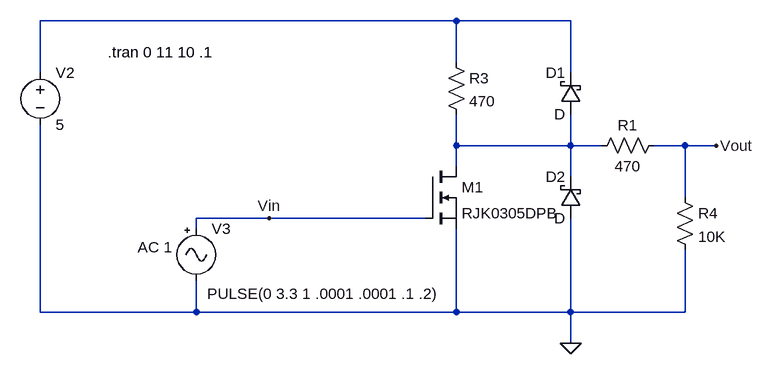
[diagram p0: schematic spank_dig_output_fet.asc]
spank_dig_output_fet.asc, the LTspice schematic file:
Version 4
SHEET 1 896 784
WIRE 176 176 -464 176
WIRE 352 176 176 176
WIRE 176 240 176 176
WIRE -464 256 -464 176
WIRE 352 256 352 176
WIRE 176 368 176 320
WIRE 352 368 352 320
WIRE 352 368 176 368
WIRE 400 368 352 368
WIRE 528 368 480 368
WIRE 576 368 528 368
WIRE 176 400 176 368
WIRE 352 416 352 368
WIRE 528 448 528 368
WIRE -112 480 -224 480
WIRE 128 480 -112 480
WIRE -224 496 -224 480
WIRE -464 624 -464 336
WIRE -224 624 -224 576
WIRE -224 624 -464 624
WIRE 176 624 176 496
WIRE 176 624 -224 624
WIRE 352 624 352 480
WIRE 352 624 176 624
WIRE 528 624 528 528
WIRE 528 624 352 624
WIRE 352 672 352 624
FLAG 352 672 0
FLAG -112 480 Vin
FLAG 576 368 Vout
SYMBOL res 496 352 R90
WINDOW 0 0 56 VBottom 2
WINDOW 3 32 56 VTop 2
SYMATTR InstName R1
SYMATTR Value 470
SYMBOL Misc\\signal -224 480 R0
WINDOW 123 -90 44 Left 2
WINDOW 39 0 0 Left 0
WINDOW 3 17 116 Left 2
SYMATTR Value2 AC 1
SYMATTR Value PULSE(0 3.3 1 .0001 .0001 .1 .2)
SYMATTR InstName V3
SYMBOL voltage -464 240 R0
WINDOW 123 0 0 Left 0
WINDOW 39 0 0 Left 0
SYMATTR InstName V2
SYMATTR Value 5
SYMBOL schottky 368 320 R180
WINDOW 0 24 64 Left 2
WINDOW 3 24 0 Left 2
SYMATTR InstName D1
SYMBOL schottky 368 480 R180
WINDOW 0 24 64 Left 2
WINDOW 3 24 0 Left 2
SYMATTR InstName D2
SYMBOL nmos 128 400 R0
SYMATTR InstName M1
SYMATTR Value RJK0305DPB
SYMBOL res 160 224 R0
SYMATTR InstName R3
SYMATTR Value 470
SYMBOL res 512 432 R0
SYMATTR InstName R4
SYMATTR Value 10K
TEXT -360 224 Left 2 !.tran 0 11 10 .1

The netlist it stands for:
* spank_dig_output_fet.asc
R1 Vout N002 470
V3 Vin 0 PULSE(0 3.3 1 .0001 .0001 .1 .2) AC 1
V2 N001 0 5
D1 N002 N001 D
D2 0 N002 D
M1 N002 Vin 0 0 RJK0305DPB
R3 N001 N002 470
R4 Vout 0 10K
.model D D
.lib standard.dio
.model NMOS NMOS
.model PMOS PMOS
.lib standard.mos
.tran 0 11 10 .1
.backanno
.end